# Altium schematic sheet STM.SchDoc
size A3; SheetNumber: 4; SheetTotal: 6
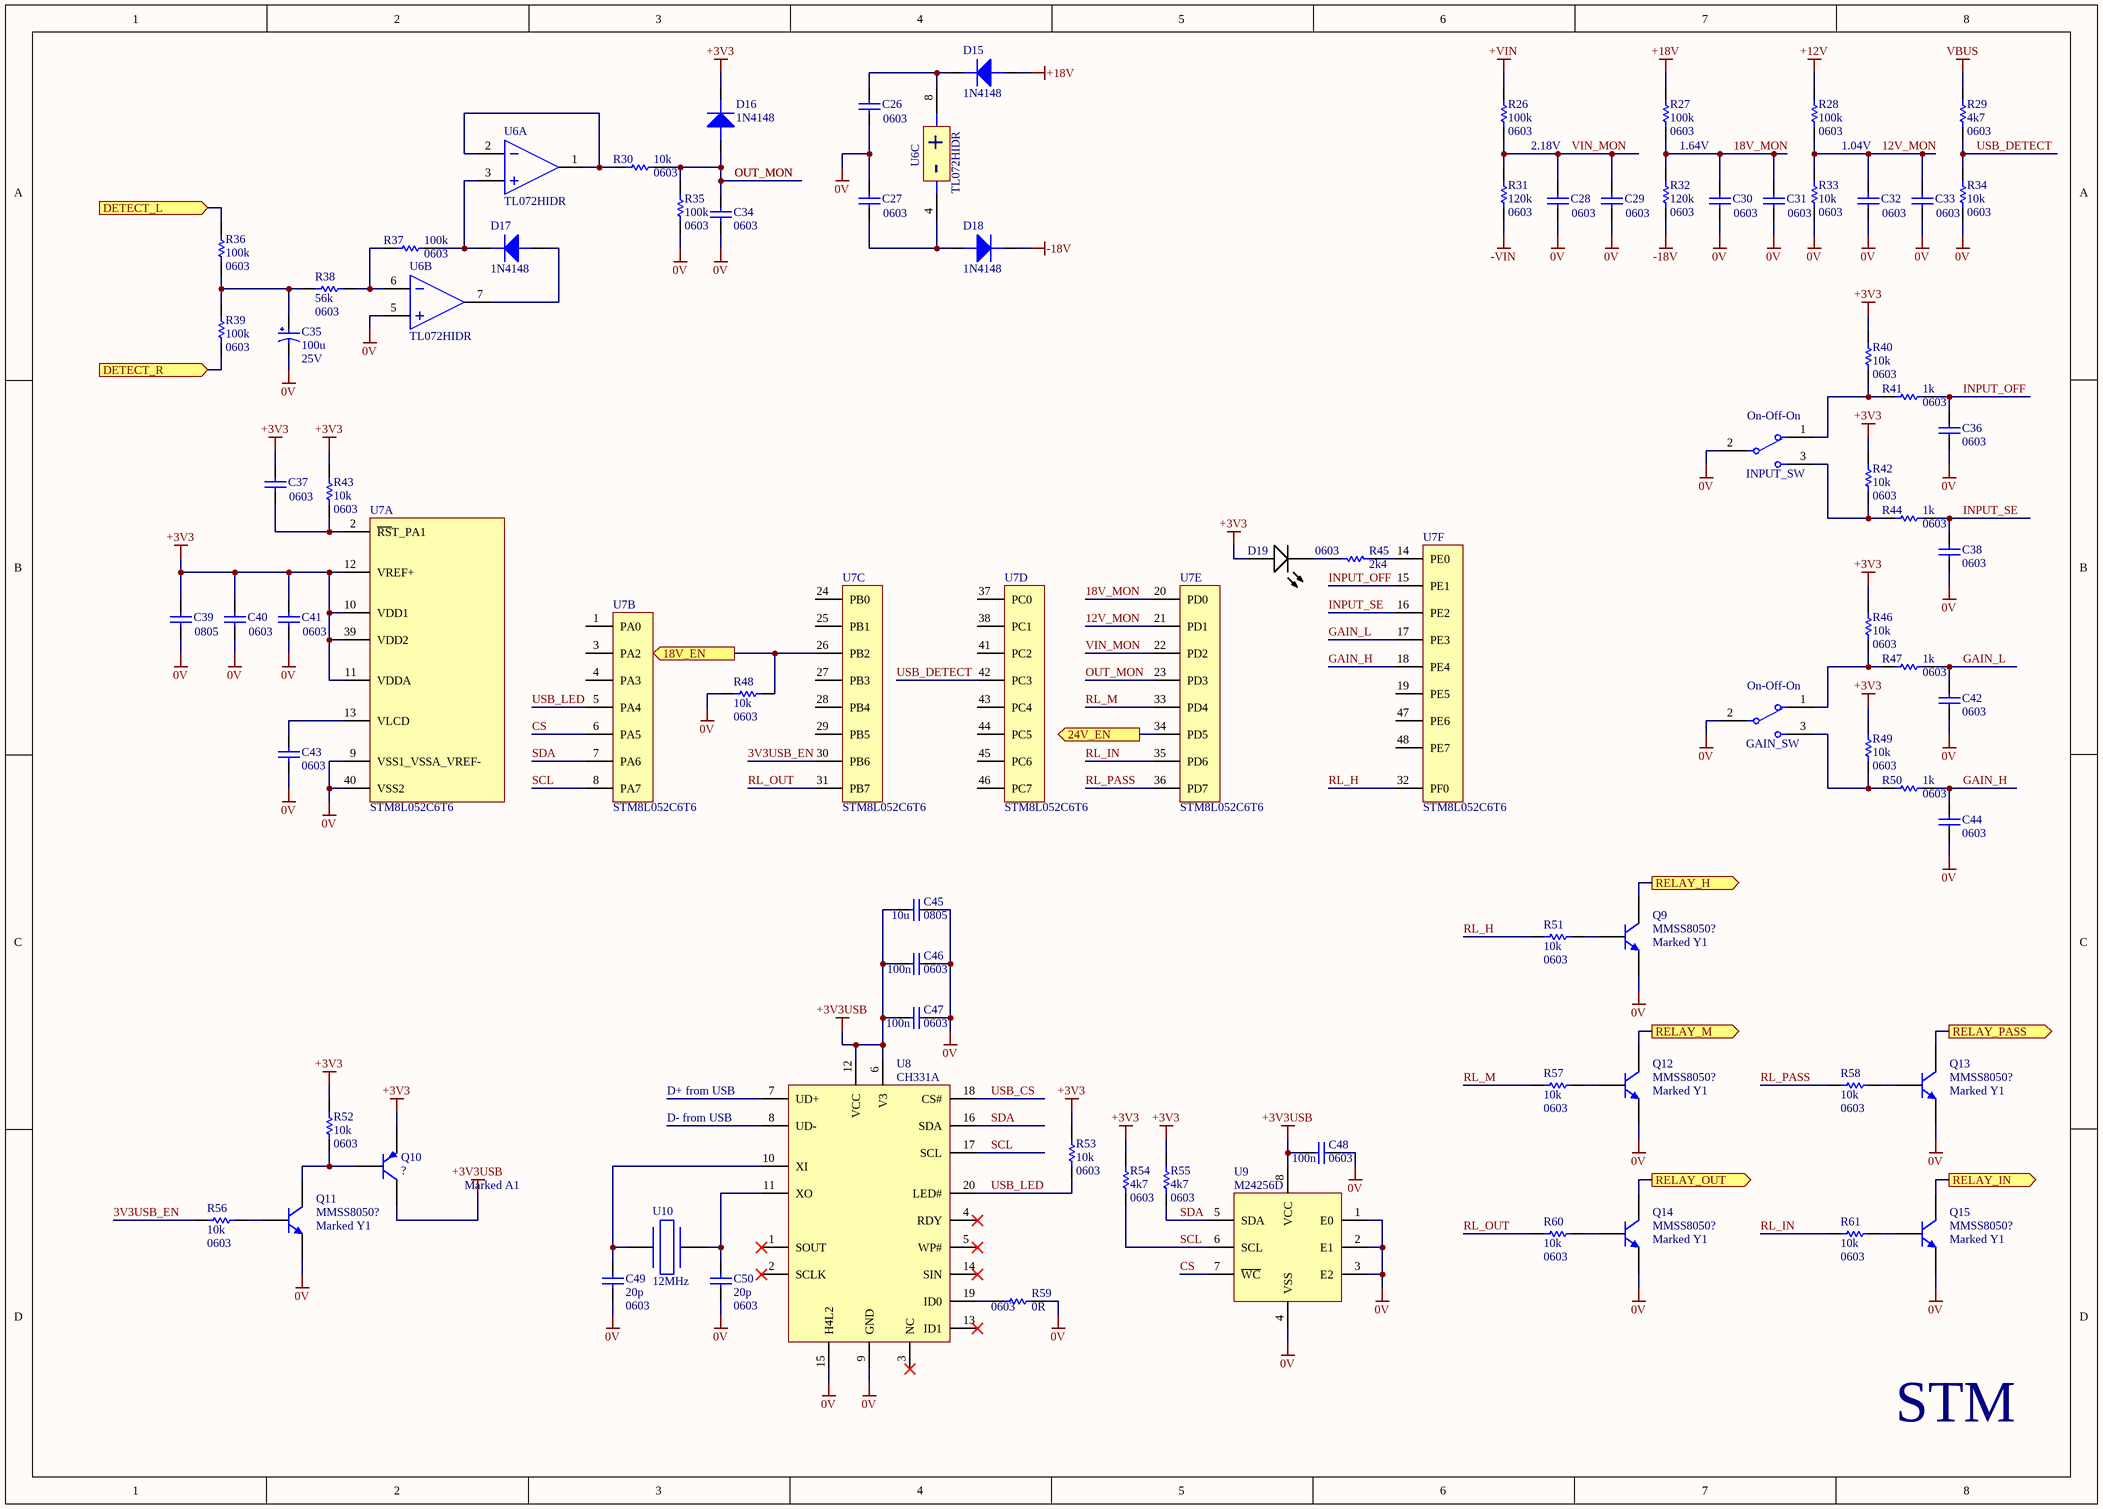
[diagram p0: STM.SchDoc]

## Parts
C26  Package: 0603  [CAPC1608X09N]  (hidden comment: C_MLCC_0603)
C27  Package: 0603  [CAPC1608X09N]  (hidden comment: C_MLCC_0603)
C28  Package: 0603  [CAPC1608X09N]  (hidden comment: C_MLCC_0603)
C29  Package: 0603  [CAPC1608X09N]  (hidden comment: C_MLCC_0603)
C30  Package: 0603  [CAPC1608X09N]  (hidden comment: C_MLCC_0603)
C31  Package: 0603  [CAPC1608X09N]  (hidden comment: C_MLCC_0603)
C32  Package: 0603  [CAPC1608X09N]  (hidden comment: C_MLCC_0603)
C33  Package: 0603  [CAPC1608X09N]  (hidden comment: C_MLCC_0603)
C34  Package: 0603  [CAPC1608X09N]  (hidden comment: C_MLCC_0603)
C35  value 100u  Notes: 25V  [CAPAE13X20]  (hidden comment: 860160378038)
C36  Package: 0603  [CAPC1608X09N]  (hidden comment: C_MLCC_0603)
C37  Package: 0603  [CAPC1608X09N]  (hidden comment: C_MLCC_0603)
C38  Package: 0603  [CAPC1608X09N]  (hidden comment: C_MLCC_0603)
C39  Package: 0805  [CAPC2012X14N]  (hidden comment: C_MLCC_0805)
C40  Package: 0603  [CAPC1608X09N]  (hidden comment: C_MLCC_0603)
C41  Package: 0603  [CAPC1608X09N]  (hidden comment: C_MLCC_0603)
C42  Package: 0603  [CAPC1608X09N]  (hidden comment: C_MLCC_0603)
C43  Package: 0603  [CAPC1608X09N]  (hidden comment: C_MLCC_0603)
C44  Package: 0603  [CAPC1608X09N]  (hidden comment: C_MLCC_0603)
C45  value 10u  Package: 0805  [CAPC2012X14N]  (hidden comment: C_MLCC_0805)
C46  value 100n  Package: 0603  [CAPC1608X09N]  (hidden comment: C_MLCC_0603)
C47  value 100n  Package: 0603  [CAPC1608X09N]  (hidden comment: C_MLCC_0603)
C48  value 100n  Package: 0603  [CAPC1608X09N]  (hidden comment: C_MLCC_0603)
C49  value 20p  Package: 0603  [CAPC1608X09N]  (hidden comment: C_MLCC_0603)
C50  value 20p  Package: 0603  [CAPC1608X09N]  (hidden comment: C_MLCC_0603)
D15  1N4148
D16  1N4148
D17  1N4148
D18  1N4148
D19  LED_TH_3mm_RED  (value not drawn)
GAIN_SW  value On-Off-On  (hidden comment: 1MS1T2B1M2QES)
INPUT_SW  value On-Off-On  (hidden comment: 1MS1T2B1M2QES)
Q9  value MMSS8050?  [SOT95P230X110-3N]  (hidden comment: MMBT5551)
Q10  (no value)  [SOT95P230X110-3N]
Q11  value MMSS8050?  [SOT95P230X110-3N]  (hidden comment: MMBT5551)
Q12  value MMSS8050?  [SOT95P230X110-3N]  (hidden comment: MMBT5551)
Q13  value MMSS8050?  [SOT95P230X110-3N]  (hidden comment: MMBT5551)
Q14  value MMSS8050?  [SOT95P230X110-3N]  (hidden comment: MMBT5551)
Q15  value MMSS8050?  [SOT95P230X110-3N]  (hidden comment: MMBT5551)
R26  value 100k  Package: 0603  [RESC1608X06N]  (hidden comment: R)
R27  value 100k  Package: 0603  [RESC1608X06N]  (hidden comment: R)
R28  value 100k  Package: 0603  [RESC1608X06N]  (hidden comment: R)
R29  value 4k7  Package: 0603  [RESC1608X06N]  (hidden comment: R)
R30  value 10k  Package: 0603  [RESC1608X06N]  (hidden comment: R)
R31  value 120k  Package: 0603  [RESC1608X06N]  (hidden comment: R)
R32  value 120k  Package: 0603  [RESC1608X06N]  (hidden comment: R)
R33  value 10k  Package: 0603  [RESC1608X06N]  (hidden comment: R)
R34  value 10k  Package: 0603  [RESC1608X06N]  (hidden comment: R)
R35  value 100k  Package: 0603  [RESC1608X06N]  (hidden comment: R)
R36  value 100k  Package: 0603  [RESC1608X06N]  (hidden comment: R)
R37  value 100k  Package: 0603  [RESC1608X06N]  (hidden comment: R)
R38  value 56k  Package: 0603  [RESC1608X06N]  (hidden comment: R)
R39  value 100k  Package: 0603  [RESC1608X06N]  (hidden comment: R)
R40  value 10k  Package: 0603  [RESC1608X06N]  (hidden comment: R)
R41  value 1k  Package: 0603  [RESC1608X06N]  (hidden comment: R)
R42  value 10k  Package: 0603  [RESC1608X06N]  (hidden comment: R)
R43  value 10k  Package: 0603  [RESC1608X06N]  (hidden comment: R)
R44  value 1k  Package: 0603  [RESC1608X06N]  (hidden comment: R)
R45  value 2k4  Package: 0603  [RESC1608X06N]  (hidden comment: R)
R46  value 10k  Package: 0603  [RESC1608X06N]  (hidden comment: R)
R47  value 1k  Package: 0603  [RESC1608X06N]  (hidden comment: R)
R48  value 10k  Package: 0603  [RESC1608X06N]  (hidden comment: R)
R49  value 10k  Package: 0603  [RESC1608X06N]  (hidden comment: R)
R50  value 1k  Package: 0603  [RESC1608X06N]  (hidden comment: R)
R51  value 10k  Package: 0603  [RESC1608X06N]  (hidden comment: R)
R52  value 10k  Package: 0603  [RESC1608X06N]  (hidden comment: R)
R53  value 10k  Package: 0603  [RESC1608X06N]  (hidden comment: R)
R54  value 4k7  Package: 0603  [RESC1608X06N]  (hidden comment: R)
R55  value 4k7  Package: 0603  [RESC1608X06N]  (hidden comment: R)
R56  value 10k  Package: 0603  [RESC1608X06N]  (hidden comment: R)
R57  value 10k  Package: 0603  [RESC1608X06N]  (hidden comment: R)
R58  value 10k  Package: 0603  [RESC1608X06N]  (hidden comment: R)
R59  value 0R  Package: 0603  [RESC1608X06N]  (hidden comment: R)
R60  value 10k  Package: 0603  [RESC1608X06N]  (hidden comment: R)
R61  value 10k  Package: 0603  [RESC1608X06N]  (hidden comment: R)
U6  TL072HIDR  [SOIC127P600X175-8L]  (parts A,B,C of 3)
U7  STM8L052C6T6  [CQFP50P900X900X160-48N]  (parts A,B,C,D,E,F of 6)
U8  CH331A  [TSOP65P640X120-20N]
U9  M24256D  [SOIC127P600X175-8L]
U10  12MHz

## Ports
18V_EN (out, see Top[3B], Power[3C]), 24V_EN (out, see Top[3B], Power[2A]), DETECT_L (in, see Top[3B]), DETECT_R (in, see Top[3B]), RELAY_H (out, see Top[3C], Input[6B]), RELAY_IN (out, see Top[3C], Input[5C]), RELAY_M (out, see Top[3C], Input[6C]), RELAY_OUT (out, see Top[3C], Output[2C]), RELAY_PASS (out, see Top[3C], Input[2C])

## Nets
0V: C26.1 C27.2 C28.1 C29.1 C30.1 C31.1 C32.1 C33.1 C34.1 C35.- C36.1 C38.1 C39.1 C40.2 C41.2 C42.1 C43.1 C44.1 C45.1 C46.1 C47.1 C48.1 C49.2 C50.2 GAIN_SW.2 INPUT_SW.2 Q9.E Q11.E Q12.E Q13.E Q14.E Q15.E R33.1 R34.1 R35.1 R48.1 R59.1 U6.5(IN2+) U7.9(VSS1_VSSA_VREF-) U7.40(VSS2) U8.9(GND) U8.15(H4L2) U9.1(E0) U9.2(E1) U9.3(E2) U9.4(VSS)
+3V3: C37.1 C39.2 C40.1 C41.1 D16.K D19.A Q10.E R40.1 R42.2 R43.2 R46.1 R49.2 R52.2 R53.2 R54.2 R55.2 U7.10(VDD1) U7.11(VDDA) U7.12(VREF+) U7.39(VDD2)
+3V3USB: C45.2 C46.2 C47.2 C48.2 Q10.C U8.6(V3) U8.12(VCC) U9.8(VCC)
+12V: R28.2
+18V: D15.A R27.2
+VIN: R26.2
-18V: D18.K R32.1
-VIN: R31.1
VBUS: R29.2
3V3USB_EN: R56.1 U7.30(PB6)
12V_MON: C32.2 C33.2 R28.1 R33.2 U7.21(PD1)
18V_EN: R48.2 U7.26(PB2) ; port 18V_EN
18V_MON: C30.2 C31.2 R27.1 R32.2 U7.20(PD0)
24V_EN: U7.34(PD5) ; port 24V_EN
CS: U7.6(PA5) U9.7(~{WC})
DETECT_L: R36.1 ; port DETECT_L
DETECT_R: R39.2 ; port DETECT_R
GAIN_H: C44.2 R50.2 U7.18(PE4)
GAIN_L: C42.2 R47.2 U7.17(PE3)
INPUT_OFF: C36.2 R41.2 U7.15(PE1)
INPUT_SE: C38.2 R44.2 U7.16(PE2)
OUT_MON: C34.2 D16.A R30.2 R35.2 U7.23(PD3)
RELAY_H: Q9.C ; port RELAY_H
RELAY_IN: Q15.C ; port RELAY_IN
RELAY_M: Q12.C ; port RELAY_M
RELAY_OUT: Q14.C ; port RELAY_OUT
RELAY_PASS: Q13.C ; port RELAY_PASS
RL_H: R51.1 U7.32(PF0)
RL_IN: R61.1 U7.35(PD6)
RL_M: R57.1 U7.33(PD4)
RL_OUT: R60.1 U7.31(PB7)
RL_PASS: R58.1 U7.36(PD7)
SCL: R54.1 U7.8(PA7) U8.17(SCL) U9.6(SCL)
SDA: R55.1 U7.7(PA6) U8.16(SDA) U9.5(SDA)
USB_CS: U8.18(CS#)
USB_DETECT: R29.1 R34.2 U7.42(PC3)
USB_LED: R53.1 U7.5(PA4) U8.20(LED#)
VIN_MON: C28.2 C29.2 R26.1 R31.2 U7.22(PD2)
NetC26_2: C26.2 D15.K U6.8(VCC+)
NetC27_1: C27.1 D18.A U6.4(VCC-)
NetC35_+: C35.+ R36.2 R38.1 R39.1
NetC37_2: C37.2 R43.1 U7.2(~{RS}T_PA1)
NetC43_2: C43.2 U7.13(VLCD)
NetC49_1: C49.1 U8.10(XI) U10.1
NetC50_1: C50.1 U8.11(XO) U10.2
NetD17_A: D17.A U6.7(OUT2)
NetD17_K: D17.K R37.2 U6.3(IN1+)
NetD19_K: D19.K R45.1
NetGAIN_SW_1: GAIN_SW.1 R46.2 R47.1
NetGAIN_SW_3: GAIN_SW.3 R49.1 R50.1
NetINPUT_SW_1: INPUT_SW.1 R40.2 R41.1
NetINPUT_SW_3: INPUT_SW.3 R42.1 R44.1
NetQ9_B: Q9.B R51.2
NetQ10_B: Q10.B Q11.C R52.1
NetQ11_B: Q11.B R56.2
NetQ12_B: Q12.B R57.2
NetQ13_B: Q13.B R58.2
NetQ14_B: Q14.B R60.2
NetQ15_B: Q15.B R61.2
NetR30_1: R30.1 U6.1(OUT1) U6.2(IN1-)
NetR37_1: R37.1 R38.2 U6.6(IN2-)
NetR45_2: R45.2 U7.14(PE0)
NetR59_2: R59.2 U8.19(ID0)

Not connected (* = marked no-connect by the designer): U7 1(PA0) 3(PA2) 4(PA3) 19(PE5) 24(PB0) 25(PB1) 27(PB3) 28(PB4) 29(PB5) 37(PC0) 38(PC1) 41(PC2) 43(PC4) 44(PC5) 45(PC6) 46(PC7) 47(PE6) 48(PE7); U8 1(SOUT)* 2(SCLK)* 3(NC)* 4(RDY)* 5(WP#)* 7(UD+) 8(UD-) 13(ID1)* 14(SIN)*

## Notes on the sheet
- 2.18V
- 1.64V
- 1.04V
- (near Q9) Marked Y1
- D+ from USB
- D- from USB
- (near Q12) Marked Y1
- (near Q13) Marked Y1
- (near Q10) Marked A1
- (near Q11) Marked Y1
- (near Q14) Marked Y1
- (near Q15) Marked Y1
- STM
- (in symbol TL072HIDR, part C) +; -

## Library data of the parts
C26-C34 C36 C38 C42-C44 C46-C50 = C_MLCC_0603: Generic MLCC 0603 Non Polarized Capacitor; Category: Capacitor; Sub-Category: MLCC; Manufacturer: Generic; Notes: *
  C26-C34 C36 C38 C42-C44: Value: *
C35 = 860160378038: Alum. Electrolytic Cap 2200µF 16V 13mm Radial WCAP-ATLL; Lifetime 7000h +105°C; Manufacturer: Würth Elektronik; Impedance: 90mR; Ripple Current: 2.082A; Polarity: Polar; Life (Hours): 7000Hour; Tolerance: 20%; Capacitance: 2.2mF; Height - Seated (Max): 0.846inch; RoHS Compliant: Yes; Max Operating Temperature: 105°C; Sub-Category: Electrolytic; Mount: Through Hole; Min Operating Temperature: -55°C; Packaging: Tape and Reel; Category: Capacitor; Package Quantity: 300; Voltage Rating: 16V; Lead Pitch: 0.197inch; Case/Package: Radial; Manufacturer Part Number: 860160378038; Component Type: Standard_Passive_C
C37 C40 C41 = C_MLCC_0603: Generic MLCC 0603 Non Polarized Capacitor; Value: 100n; Category: Capacitor; Sub-Category: MLCC; Manufacturer: Generic; Notes: *
C39 C45 = C_MLCC_0805: Generic MLCC 0805 Non Polarized Capacitor; Category: Capacitor; Sub-Category: MLCC; Manufacturer: Generic; Notes: *
  C39: Value: *
D15-D18 = 1N4148: Generic small signal diode; Manufacturer Part Number: BAT48ZFILM; Number of Elements: 1; Rep Pk Reverse Voltage-Max: 40V; Package Body Material: Plastic; Diode Type: RECTIFIER; Forward Voltage-Max (VF): 250mV; Non-rep Pk Forward Current-Max: 2A; Diode Element Material: SILICON; Time @ Peak Reflow Temperature-Max (s): 30s; Max Output Current: 350mA; Qualification Status: Not Qualified; Peak Reflow Temperature (Cel): 260°C; Max Operating Temperature: 150°C; Terminal Position: DUAL; Technology: SCHOTTKY; JESD-30 Code: R-PDSO-G2; Category: Diode; Surface Mount: Yes; RoHS Compliant: Yes; Manufacturer: Generic; Number of Pins: 2; Sub-Category: Signal; Terminal Form: Gull Wing; REACH SVHC: Yes; JESD-609 Code: e3; Package Shape: Rectangular; Package Style: SMALL OUTLINEMeter; Terminal Finish: Tin; Component Type: Standard_Diode; Value: 1N4148
D19 = LED_TH_3mm_RED: Generic Through Hole 3mm Red Led; Manufacturer: Generic; Category: Diode; Sub-Category: LED; Value: LED_TH_3mm_RED
GAIN_SW INPUT_SW = 1MS1T2B1M2QES: Mini Toggle Switch 1M Series SPDT ON-ON Short Lever PC Through-Hole; Manufacturer: Dailywell; Category: Switch; Sub-Category: Mechanical
Q9 Q11-Q15 = MMBT5551: NPN General-Purpose / Amplifier; pin to pad: B>1 C>3 E>2; Manufacturer: On Semi; Manufacturer Part Number: MMBT3904VL; Package Body Material: Plastic; JEDEC-95 Code: TO-236AB; Transistor Application: SWITCHING; Max Collector Current: 200mA; DC Current Gain-Min (hFE): 30; Turn-on Time-Max (ton): 70ns; Turn-off Time-Max (toff): 250ns; Transistor Element Material: SILICON; Number of Elements: 1; Transition Frequency-Nom (fT): 300MHz; Collector-emitter Voltage-Max: 40V; Package Shape: Rectangular; JESD-30 Code: R-PDSO-G3; Number of Pins: 3; REACH SVHC: Yes; Sub-Category: BJT; RoHS Compliant: Yes; Terminal Position: DUAL; Surface Mount: Yes; Terminal Form: Gull Wing; Package Style: SMALL OUTLINEMeter; Polarity/Channel Type: NPN; Category: Transistor; Component Type: Standard_Transistor
Q10 = MMBT5401: PNP Epitaxial Silicon Transistor; pin to pad: B>1 C>3 E>2; Manufacturer: MCC; Manufacturer Part Number: MMBT3904VL; Package Body Material: Plastic; JEDEC-95 Code: TO-236AB; Transistor Application: SWITCHING; Max Collector Current: 200mA; DC Current Gain-Min (hFE): 30; Turn-on Time-Max (ton): 70ns; Turn-off Time-Max (toff): 250ns; Number of Elements: 1; Polarity/Channel Type: NPN; Transition Frequency-Nom (fT): 300MHz; Collector-emitter Voltage-Max: 40V; Package Shape: Rectangular; JESD-30 Code: R-PDSO-G3; Number of Pins: 3; REACH SVHC: Yes; Sub-Category: BJT; RoHS Compliant: Yes; Transistor Element Material: SILICON; Terminal Position: DUAL; Surface Mount: Yes; Terminal Form: Gull Wing; Package Style: SMALL OUTLINEMeter; Category: Transistor; Component Type: Standard_Transistor; Value: ?
R26-R61 = R_0603: Generic 0603 Single Resistor; Manufacturer: Generic; Category: Resistor; Sub-Category: SMD; Notes: *
U6 = TL072HIDR: Operational Amplifiers - Op Amps Dual Low Noise Op Amp; Manufacturer: Texas Instruments; Category: IC; Sub-Category: OpAmp; Package: SOIC8; Value: TL072HIDR
U7 = STM8L052C6T6: Value Line, 8-bit ultra-low-power MCU, 32-KB Flash, 256-byte data / EEPROM, RTC, LCD, timers, USART, I2C, SPI, ADC; Manufacturer: ST Microelectronics; Category: IC; Sub-Category: CPU; Value: STM8L052C6T6
U8 = CH331A: USB 2.0 SSOP-20-208mil USB Converters ROHS; Manufacturer: WCH; Category: IC; Sub-Category: USB; Package: SSOP20; Value: CH331A
U9 = M24256D: 256-Kbit serial I²C bus EEPROM; Manufacturer: ST Microelectronics; Category: IC; Sub-Category: Memory; Package: SOIC8; Value: M24256D
U10 = Xtal: Generic Xtal